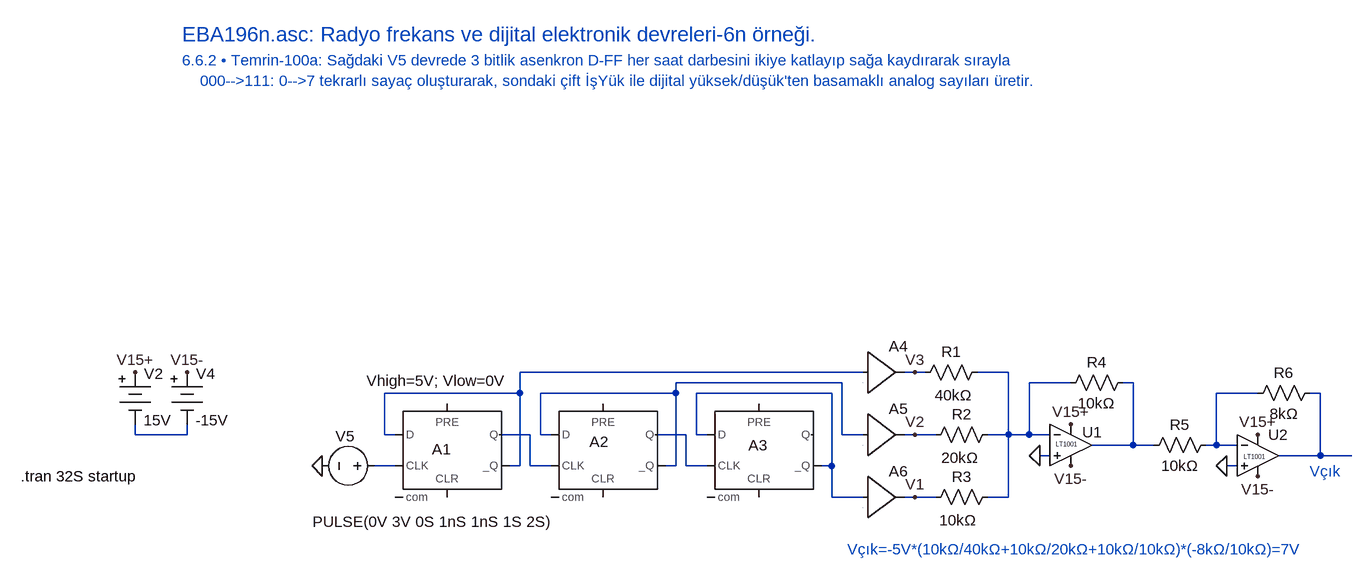
[diagram p0: schematic EBA196n.asc]
EBA196n.asc, the LTspice schematic file:
Version 4
SHEET 1 7064 4332
WIRE 816 576 288 576
WIRE 896 576 880 576
WIRE 912 576 896 576
WIRE 1040 576 992 576
WIRE 784 592 528 592
WIRE 1136 592 1072 592
WIRE 1232 592 1216 592
WIRE 288 608 288 576
WIRE 288 608 80 608
WIRE 528 608 528 592
WIRE 528 608 320 608
WIRE 768 608 560 608
WIRE 1424 608 1360 608
WIRE 1520 608 1504 608
WIRE -304 672 -304 656
WIRE -224 672 -224 656
WIRE -224 672 -304 672
WIRE 80 672 80 608
WIRE 96 672 80 672
WIRE 304 672 256 672
WIRE 320 672 320 608
WIRE 336 672 320 672
WIRE 544 672 496 672
WIRE 560 672 560 608
WIRE 576 672 560 672
WIRE 784 672 784 592
WIRE 816 672 784 672
WIRE 896 672 880 672
WIRE 928 672 896 672
WIRE 1040 672 1040 576
WIRE 1040 672 1008 672
WIRE 1072 672 1072 592
WIRE 1072 672 1040 672
WIRE 1104 672 1072 672
WIRE 1232 688 1232 592
WIRE 1232 688 1168 688
WIRE 1264 688 1232 688
WIRE 1360 688 1360 608
WIRE 1360 688 1344 688
WIRE 1392 688 1360 688
WIRE 1104 704 1088 704
WIRE 1520 704 1520 608
WIRE 1520 704 1456 704
WIRE 1568 704 1520 704
WIRE 96 720 64 720
WIRE 288 720 288 608
WIRE 288 720 272 720
WIRE 304 720 304 672
WIRE 336 720 304 720
WIRE 528 720 528 608
WIRE 528 720 512 720
WIRE 544 720 544 672
WIRE 576 720 544 720
WIRE 768 720 768 608
WIRE 768 720 752 720
WIRE 1392 720 1376 720
WIRE 768 768 768 720
WIRE 816 768 768 768
WIRE 896 768 880 768
WIRE 928 768 896 768
WIRE 1040 768 1040 672
WIRE 1040 768 1008 768
FLAG -304 576 V15+
FLAG -16 720 0
FLAG 1088 704 0
FLAG 896 576 V3
FLAG 896 672 V2
FLAG 896 768 V1
FLAG 1376 720 0
FLAG 1136 656 V15+
FLAG 1424 672 V15+
FLAG -224 576 V15-
FLAG 1136 720 V15-
FLAG 1424 736 V15-
SYMBOL Misc\\battery -304 560 R0
WINDOW 0 14 18 Left 2
WINDOW 3 13 90 Left 2
SYMATTR InstName V2
SYMATTR Value 15V
SYMBOL Digital\\dflop 176 624 R0
WINDOW 0 -23 70 Left 2
WINDOW 3 0 0 Invisible 0
WINDOW 123 -124 -35 Left 2
SYMATTR InstName A1
SYMATTR Value Ref=2.5V
SYMATTR Value2 Vhigh=5V; Vlow=0V
SYMATTR SpiceLine Td=20nS   Trise=10nS Tfall=10nS
SYMATTR SpiceLine2 tripdt=5nS
SYMBOL voltage 80 720 R90
WINDOW 3 86 -256 VRight 2
WINDOW 123 0 0 Left 0
WINDOW 39 0 0 Left 0
WINDOW 0 -46 46 VRight 2
SYMATTR Value PULSE(0V 3V 0S 1nS 1nS 1S 2S)
SYMATTR InstName V5
SYMBOL Digital\\dflop 416 624 R0
WINDOW 0 -21 59 Left 2
WINDOW 3 0 0 Invisible 0
SYMATTR InstName A2
SYMATTR Value Ref=2.5
SYMATTR Value2 Vhigh=5V; Vlow=0
SYMATTR SpiceLine Td=20n   Trise=10n Tfall=10n
SYMATTR SpiceLine2 tripdt=5n
SYMBOL Digital\\dflop 656 624 R0
WINDOW 0 -16 64 Left 2
WINDOW 3 0 0 Invisible 0
SYMATTR InstName A3
SYMATTR Value Ref=2.5
SYMATTR Value2 Vhigh=5V; Vlow=0
SYMATTR SpiceLine Td=20n   Trise=10n Tfall=10n
SYMATTR SpiceLine2 tripdt=5n
SYMBOL Opamps\\LT1001 1136 624 R0
WINDOW 3 -23 63 Left 0
WINDOW 0 18 44 Left 2
SYMATTR InstName U1
SYMBOL res 1008 560 R90
WINDOW 0 0 56 VBottom 2
WINDOW 3 36 52 VTop 2
SYMATTR InstName R1
SYMATTR Value 40kΩ
SYMBOL res 1024 656 R90
WINDOW 0 0 56 VBottom 2
WINDOW 3 36 58 VTop 2
SYMATTR InstName R2
SYMATTR Value 20kΩ
SYMBOL res 1024 752 R90
WINDOW 0 0 56 VBottom 2
WINDOW 3 36 61 VTop 2
SYMATTR InstName R3
SYMATTR Value 10kΩ
SYMBOL res 1232 576 R90
WINDOW 0 0 56 VBottom 2
WINDOW 3 32 56 VTop 2
SYMATTR InstName R4
SYMATTR Value 10kΩ
SYMBOL Opamps\\LT1001 1424 640 R0
WINDOW 3 -22 66 Left 0
SYMATTR InstName U2
SYMBOL res 1360 672 R90
WINDOW 0 0 56 VBottom 2
WINDOW 3 32 56 VTop 2
SYMATTR InstName R5
SYMATTR Value 10kΩ
SYMBOL res 1520 592 R90
WINDOW 0 0 56 VBottom 2
WINDOW 3 32 56 VTop 2
SYMATTR InstName R6
SYMATTR Value 8kΩ
SYMBOL Digital\\buf1 816 512 R0
SYMATTR InstName A4
SYMATTR Value2 Vhigh=5  Vlow=0
SYMATTR SpiceLine td=10n
SYMBOL Digital\\buf1 816 608 R0
SYMATTR InstName A5
SYMATTR Value2 Vhigh=5  Vlow=0
SYMATTR SpiceLine td=10n
SYMBOL Digital\\buf1 816 704 R0
SYMATTR InstName A6
SYMATTR Value2 Vhigh=5  Vlow=0
SYMATTR SpiceLine td=10n
SYMBOL Misc\\battery -224 560 R0
WINDOW 0 14 18 Left 2
WINDOW 3 13 90 Left 2
SYMATTR InstName V4
SYMATTR Value -15V
TEXT -232 56 Left 3 ;EBA196n.asc: Radyo frekans ve dijital elektronik devreleri-6n örneği.
TEXT -232 96 Left 2 ;6.6.2 • Temrin-100a: Sağdaki V5 devrede 3 bitlik asenkron D-FF her saat darbesini ikiye katlayıp sağa kaydırarak sırayla \n    000-->111: 0-->7 tekrarlı sayaç oluşturarak, sondaki çift İşYük ile dijital yüksek/düşük'ten basamaklı analog sayıları üretir.
TEXT -480 736 Left 2 !.tran 32S startup
TEXT 1504 728 Left 2 ;Vçık
TEXT 792 848 Left 2 ;Vçık=-5V*(10kΩ/40kΩ+10kΩ/20kΩ+10kΩ/10kΩ)*(-8kΩ/10kΩ)=7V

The netlist it stands for:
* EBA196n.asc
V2 V15+ N008 15V
A1 N001 0 N011 0 0 N001 N009 0 DFLOP Ref=2.5V Vhigh=5V; Vlow=0V Td=20nS   Trise=10nS Tfall=10nS tripdt=5nS
V5 N011 0 PULSE(0V 3V 0S 1nS 1nS 1S 2S)
A2 N003 0 N009 0 0 N003 N010 0 DFLOP Ref=2.5 Vhigh=5V; Vlow=0 Td=20n   Trise=10n Tfall=10n tripdt=5n
A3 N005 0 N010 0 0 N005 0 0 DFLOP Ref=2.5 Vhigh=5V; Vlow=0 Td=20n   Trise=10n Tfall=10n tripdt=5n
XU1 0 N002 V15+ V15- N004 LT1001  ; pins In+ In- V+ V- OUT
R1 N002 V3 40kΩ
R2 N002 V2 20kΩ
R3 N002 V1 10kΩ
R4 N004 N002 10kΩ
XU2 0 N006 V15+ V15- N007 LT1001  ; pins In+ In- V+ V- OUT
R5 N006 N004 10kΩ
R6 N007 N006 8kΩ
A4 N001 0 0 0 0 0 V3 0 BUF Vhigh=5  Vlow=0 td=10n
A5 N003 0 0 0 0 0 V2 0 BUF Vhigh=5  Vlow=0 td=10n
A6 N005 0 0 0 0 0 V1 0 BUF Vhigh=5  Vlow=0 td=10n
V4 V15- N008 -15V
* EBA196n.asc: Radyo frekans ve dijital elektronik devreleri-6n örneği.
* 6.6.2 • Temrin-100a: Sağdaki V5 devrede 3 bitlik asenkron D-FF her saat darbesini ikiye katlayıp sağa kaydırarak sırayla
*     000-->111: 0-->7 tekrarlı sayaç oluşturarak, sondaki çift İşYük ile dijital yüksek/düşük'ten basamaklı analog sayıları üretir.
.tran 32S startup
* Vçık
* Vçık=-5V*(10kΩ/40kΩ+10kΩ/20kΩ+10kΩ/10kΩ)*(-8kΩ/10kΩ)=7V
.lib LTC.lib
.backanno
.end